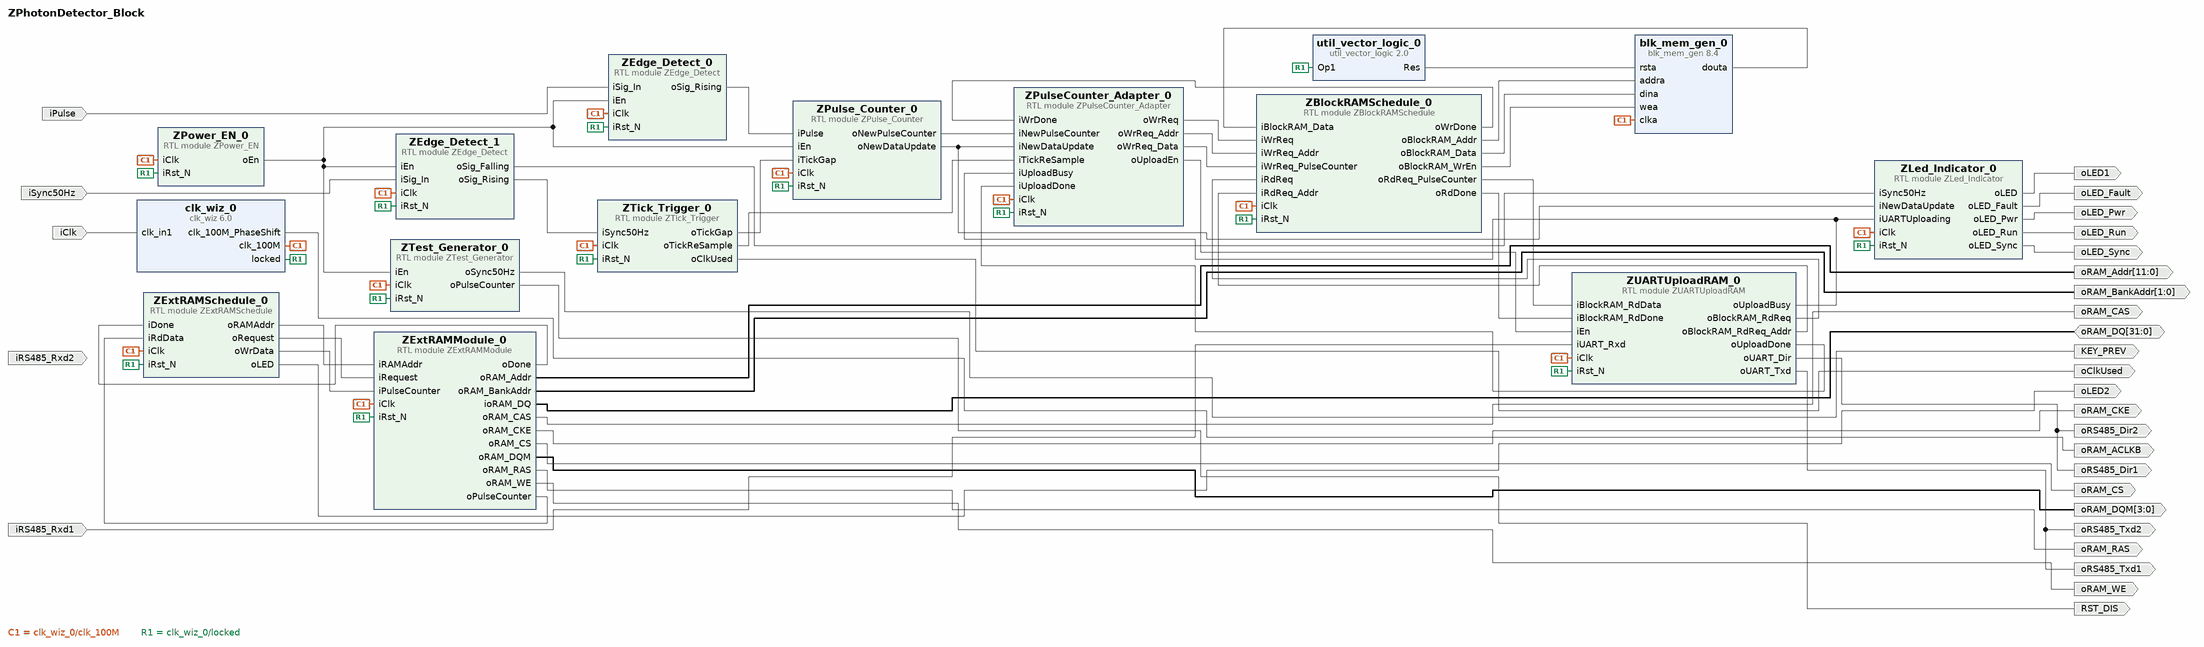
[diagram p0: block diagram of the top level]
# Vivado block design ZPhotonDetector_Block, xc7s25ftgb196-1, Vivado 2023.1
create_bd_design ZPhotonDetector_Block

create_bd_port -dir I -type clk iClk
set_property -dict {CONFIG.FREQ_HZ 100000000} [get_bd_ports iClk]
create_bd_port -dir I -type intr iPulse
create_bd_port -dir O -type data oRS485_Dir2
create_bd_port -dir O -type data oRS485_Txd2
create_bd_port -dir O -type data oRS485_Txd1
create_bd_port -dir O oRS485_Dir1
create_bd_port -dir O -from 11 -to 0 -type data oRAM_Addr
create_bd_port -dir O -from 1 -to 0 -type data oRAM_BankAddr
create_bd_port -dir O oRAM_CS
create_bd_port -dir O oRAM_WE
create_bd_port -dir O oRAM_CAS
create_bd_port -dir O oRAM_RAS
create_bd_port -dir O -type clk oRAM_ACLKB
create_bd_port -dir O -type ce oRAM_CKE
create_bd_port -dir O -from 3 -to 0 oRAM_DQM
create_bd_port -dir IO -from 31 -to 0 -type data oRAM_DQ
create_bd_port -dir O -type data oLED1
create_bd_port -dir O oLED2
create_bd_port -dir I iSync50Hz
create_bd_port -dir I iRS485_Rxd2
create_bd_port -dir I iRS485_Rxd1
create_bd_port -dir O oLED_Pwr
create_bd_port -dir O oLED_Run
create_bd_port -dir O oLED_Fault
create_bd_port -dir O oLED_Sync
create_bd_port -dir O KEY_PREV
create_bd_port -dir O RST_DIS
create_bd_port -dir O oClkUsed

create_bd_cell -type ip -vlnv xilinx.com:ip:clk_wiz:6.0 clk_wiz_0
set_property -dict [list \
  CONFIG.CLKOUT1_DRIVES BUFG \
  CONFIG.CLKOUT1_JITTER 137.681 \
  CONFIG.CLKOUT1_PHASE_ERROR 105.461 \
  CONFIG.CLKOUT1_REQUESTED_OUT_FREQ 100.0 \
  CONFIG.CLKOUT2_DRIVES BUFG \
  CONFIG.CLKOUT2_JITTER 137.681 \
  CONFIG.CLKOUT2_PHASE_ERROR 105.461 \
  CONFIG.CLKOUT2_REQUESTED_OUT_FREQ 100.0 \
  CONFIG.CLKOUT2_REQUESTED_PHASE 120 \
  CONFIG.CLKOUT2_USED true \
  CONFIG.CLKOUT3_DRIVES BUFG \
  CONFIG.CLKOUT3_JITTER 159.475 \
  CONFIG.CLKOUT3_PHASE_ERROR 105.461 \
  CONFIG.CLKOUT3_REQUESTED_OUT_FREQ 50.000 \
  CONFIG.CLKOUT3_USED false \
  CONFIG.CLKOUT4_DRIVES BUFG \
  CONFIG.CLKOUT5_DRIVES BUFG \
  CONFIG.CLKOUT6_DRIVES BUFG \
  CONFIG.CLKOUT7_DRIVES BUFG \
  CONFIG.CLK_OUT1_PORT clk_100M \
  CONFIG.CLK_OUT2_PORT clk_100M_PhaseShift \
  CONFIG.CLK_OUT3_PORT clk_50M \
  CONFIG.MMCM_BANDWIDTH OPTIMIZED \
  CONFIG.MMCM_CLKFBOUT_MULT_F 9 \
  CONFIG.MMCM_CLKOUT0_DIVIDE_F 9 \
  CONFIG.MMCM_CLKOUT1_DIVIDE 9 \
  CONFIG.MMCM_CLKOUT1_PHASE 120.000 \
  CONFIG.MMCM_CLKOUT2_DIVIDE 1 \
  CONFIG.MMCM_COMPENSATION ZHOLD \
  CONFIG.NUM_OUT_CLKS 2 \
  CONFIG.PRIMITIVE PLL \
  CONFIG.PRIM_IN_FREQ 100.000 \
  CONFIG.PRIM_SOURCE Single_ended_clock_capable_pin \
  CONFIG.USE_RESET false \
] [get_bd_cells clk_wiz_0]
create_bd_cell -type module -reference ZPower_EN ZPower_EN_0
create_bd_cell -type module -reference ZEdge_Detect ZEdge_Detect_0
create_bd_cell -type ip -vlnv xilinx.com:ip:blk_mem_gen:8.4 blk_mem_gen_0
set_property -dict [list \
  CONFIG.Enable_A Always_Enabled \
  CONFIG.Register_PortA_Output_of_Memory_Core true \
  CONFIG.Register_PortA_Output_of_Memory_Primitives false \
  CONFIG.Reset_Priority_A CE \
  CONFIG.Use_RSTA_Pin true \
  CONFIG.Write_Depth_A 3002 \
  CONFIG.Write_Width_A 16 \
  CONFIG.use_bram_block Stand_Alone \
] [get_bd_cells blk_mem_gen_0]
create_bd_cell -type module -reference ZEdge_Detect ZEdge_Detect_1
create_bd_cell -type module -reference ZExtRAMSchedule ZExtRAMSchedule_0
create_bd_cell -type module -reference ZTest_Generator ZTest_Generator_0
create_bd_cell -type module -reference ZExtRAMModule ZExtRAMModule_0
create_bd_cell -type ip -vlnv xilinx.com:ip:util_vector_logic:2.0 util_vector_logic_0
set_property -dict {CONFIG.C_OPERATION not CONFIG.C_SIZE 1} [get_bd_cells util_vector_logic_0]
create_bd_cell -type module -reference ZBlockRAMSchedule ZBlockRAMSchedule_0
create_bd_cell -type module -reference ZUARTUploadRAM ZUARTUploadRAM_0
create_bd_cell -type module -reference ZPulse_Counter ZPulse_Counter_0
create_bd_cell -type module -reference ZTick_Trigger ZTick_Trigger_0
create_bd_cell -type module -reference ZLed_Indicator ZLed_Indicator_0
create_bd_cell -type module -reference ZPulseCounter_Adapter ZPulseCounter_Adapter_0

# ---- connections ----

connect_bd_net [get_bd_ports oRAM_DQ] [get_bd_pins ZExtRAMModule_0/ioRAM_DQ]
connect_bd_net [get_bd_pins ZBlockRAMSchedule_0/oBlockRAM_Addr] [get_bd_pins blk_mem_gen_0/addra]
connect_bd_net [get_bd_pins ZBlockRAMSchedule_0/oBlockRAM_Data] [get_bd_pins blk_mem_gen_0/dina]
connect_bd_net [get_bd_pins ZBlockRAMSchedule_0/oBlockRAM_WrEn] [get_bd_pins blk_mem_gen_0/wea]
connect_bd_net -net ZBlockRAMSchedule_0_oPulseCounter [get_bd_pins ZBlockRAMSchedule_0/oRdReq_PulseCounter] \
  [get_bd_pins ZUARTUploadRAM_0/iBlockRAM_RdData]
connect_bd_net [get_bd_pins ZBlockRAMSchedule_0/oRdDone] [get_bd_pins ZUARTUploadRAM_0/iBlockRAM_RdDone]
connect_bd_net [get_bd_pins ZBlockRAMSchedule_0/oWrDone] [get_bd_pins ZPulseCounter_Adapter_0/iWrDone]
connect_bd_net [get_bd_pins ZEdge_Detect_0/oSig_Rising] [get_bd_pins ZPulse_Counter_0/iPulse]
connect_bd_net [get_bd_pins ZEdge_Detect_1/oSig_Falling] [get_bd_pins ZLed_Indicator_0/iSync50Hz]
connect_bd_net [get_bd_pins ZEdge_Detect_1/oSig_Rising] [get_bd_pins ZTick_Trigger_0/iSync50Hz]
connect_bd_net [get_bd_pins ZExtRAMModule_0/oDone] [get_bd_pins ZExtRAMSchedule_0/iDone]
connect_bd_net [get_bd_pins ZExtRAMModule_0/oPulseCounter] [get_bd_pins ZExtRAMSchedule_0/iRdData]
connect_bd_net [get_bd_pins ZExtRAMModule_0/oRAM_Addr] [get_bd_ports oRAM_Addr]
connect_bd_net [get_bd_pins ZExtRAMModule_0/oRAM_BankAddr] [get_bd_ports oRAM_BankAddr]
connect_bd_net [get_bd_pins ZExtRAMModule_0/oRAM_CAS] [get_bd_ports oRAM_CAS]
connect_bd_net [get_bd_pins ZExtRAMModule_0/oRAM_CKE] [get_bd_ports oRAM_CKE]
connect_bd_net [get_bd_pins ZExtRAMModule_0/oRAM_CS] [get_bd_ports oRAM_CS]
connect_bd_net [get_bd_pins ZExtRAMModule_0/oRAM_DQM] [get_bd_ports oRAM_DQM]
connect_bd_net [get_bd_pins ZExtRAMModule_0/oRAM_RAS] [get_bd_ports oRAM_RAS]
connect_bd_net [get_bd_pins ZExtRAMModule_0/oRAM_WE] [get_bd_ports oRAM_WE]
connect_bd_net [get_bd_pins ZExtRAMSchedule_0/oLED] [get_bd_ports oLED2]
connect_bd_net [get_bd_pins ZExtRAMSchedule_0/oRAMAddr] [get_bd_pins ZExtRAMModule_0/iRAMAddr]
connect_bd_net [get_bd_pins ZExtRAMSchedule_0/oRequest] [get_bd_pins ZExtRAMModule_0/iRequest]
connect_bd_net [get_bd_pins ZExtRAMSchedule_0/oWrData] [get_bd_pins ZExtRAMModule_0/iPulseCounter]
connect_bd_net [get_bd_pins ZLed_Indicator_0/oLED] [get_bd_ports oLED1]
connect_bd_net [get_bd_pins ZLed_Indicator_0/oLED_Fault] [get_bd_ports oLED_Fault]
connect_bd_net [get_bd_pins ZLed_Indicator_0/oLED_Pwr] [get_bd_ports oLED_Pwr]
connect_bd_net [get_bd_pins ZLed_Indicator_0/oLED_Run] [get_bd_ports oLED_Run]
connect_bd_net [get_bd_pins ZLed_Indicator_0/oLED_Sync] [get_bd_ports oLED_Sync]
connect_bd_net -net ZPulseCounter_Adapter_0_oWrFrameDone [get_bd_pins ZPulseCounter_Adapter_0/oUploadEn] [get_bd_pins ZUARTUploadRAM_0/iEn]
connect_bd_net [get_bd_pins ZPulseCounter_Adapter_0/oWrReq] [get_bd_pins ZBlockRAMSchedule_0/iWrReq]
connect_bd_net [get_bd_pins ZPulseCounter_Adapter_0/oWrReq_Addr] [get_bd_pins ZBlockRAMSchedule_0/iWrReq_Addr]
connect_bd_net [get_bd_pins ZPulseCounter_Adapter_0/oWrReq_Data] [get_bd_pins ZBlockRAMSchedule_0/iWrReq_PulseCounter]
connect_bd_net [get_bd_pins ZPulse_Counter_0/oNewDataUpdate] \
  [get_bd_pins ZLed_Indicator_0/iNewDataUpdate] [get_bd_pins ZPulseCounter_Adapter_0/iNewDataUpdate]
connect_bd_net [get_bd_pins ZPulse_Counter_0/oNewPulseCounter] [get_bd_pins ZPulseCounter_Adapter_0/iNewPulseCounter]
connect_bd_net [get_bd_pins ZTest_Generator_0/oPulseCounter] [get_bd_ports RST_DIS]
connect_bd_net [get_bd_pins ZTest_Generator_0/oSync50Hz] [get_bd_ports KEY_PREV]
connect_bd_net [get_bd_pins ZTick_Trigger_0/oClkUsed] [get_bd_ports oClkUsed]
connect_bd_net [get_bd_pins ZTick_Trigger_0/oTickGap] [get_bd_pins ZPulse_Counter_0/iTickGap]
connect_bd_net [get_bd_pins ZTick_Trigger_0/oTickReSample] [get_bd_pins ZPulseCounter_Adapter_0/iTickReSample]
connect_bd_net [get_bd_pins ZUARTUploadRAM_0/oBlockRAM_RdReq] [get_bd_pins ZBlockRAMSchedule_0/iRdReq]
connect_bd_net [get_bd_pins ZUARTUploadRAM_0/oBlockRAM_RdReq_Addr] [get_bd_pins ZBlockRAMSchedule_0/iRdReq_Addr]
connect_bd_net [get_bd_pins ZUARTUploadRAM_0/oUART_Dir] [get_bd_ports oRS485_Dir2] [get_bd_ports oRS485_Dir1]
connect_bd_net [get_bd_pins ZUARTUploadRAM_0/oUART_Txd] [get_bd_ports oRS485_Txd2] [get_bd_ports oRS485_Txd1]
connect_bd_net [get_bd_pins ZUARTUploadRAM_0/oUploadBusy] \
  [get_bd_pins ZLed_Indicator_0/iUARTUploading] [get_bd_pins ZPulseCounter_Adapter_0/iUploadBusy]
connect_bd_net [get_bd_pins ZUARTUploadRAM_0/oUploadDone] [get_bd_pins ZPulseCounter_Adapter_0/iUploadDone]
connect_bd_net [get_bd_pins blk_mem_gen_0/douta] [get_bd_pins ZBlockRAMSchedule_0/iBlockRAM_Data]
connect_bd_net [get_bd_pins clk_wiz_0/clk_100M_PhaseShift] [get_bd_ports oRAM_ACLKB]
connect_bd_net -net clk_wiz_0_clk_50M [get_bd_pins clk_wiz_0/clk_100M] \
  [get_bd_pins ZPower_EN_0/iClk] [get_bd_pins ZEdge_Detect_0/iClk] [get_bd_pins blk_mem_gen_0/clka] \
  [get_bd_pins ZEdge_Detect_1/iClk] [get_bd_pins ZExtRAMSchedule_0/iClk] [get_bd_pins ZTest_Generator_0/iClk] \
  [get_bd_pins ZExtRAMModule_0/iClk] [get_bd_pins ZBlockRAMSchedule_0/iClk] [get_bd_pins ZUARTUploadRAM_0/iClk] \
  [get_bd_pins ZPulse_Counter_0/iClk] [get_bd_pins ZTick_Trigger_0/iClk] [get_bd_pins ZLed_Indicator_0/iClk] \
  [get_bd_pins ZPulseCounter_Adapter_0/iClk]
connect_bd_net [get_bd_ports iClk] [get_bd_pins clk_wiz_0/clk_in1]
connect_bd_net -net iEn_1 [get_bd_pins ZPower_EN_0/oEn] \
  [get_bd_pins ZEdge_Detect_0/iEn] [get_bd_pins ZEdge_Detect_1/iEn] [get_bd_pins ZTest_Generator_0/iEn] \
  [get_bd_pins ZPulse_Counter_0/iEn]
connect_bd_net [get_bd_ports iPulse] [get_bd_pins ZEdge_Detect_0/iSig_In]
connect_bd_net -net iRS485_Rxd1_1 [get_bd_ports iRS485_Rxd1] [get_bd_pins ZUARTUploadRAM_0/iUART_Rxd]
connect_bd_net -net iRst_N_1 [get_bd_pins clk_wiz_0/locked] \
  [get_bd_pins ZPower_EN_0/iRst_N] [get_bd_pins ZEdge_Detect_0/iRst_N] [get_bd_pins ZEdge_Detect_1/iRst_N] \
  [get_bd_pins ZExtRAMSchedule_0/iRst_N] [get_bd_pins ZTest_Generator_0/iRst_N] [get_bd_pins ZExtRAMModule_0/iRst_N] \
  [get_bd_pins util_vector_logic_0/Op1] [get_bd_pins ZBlockRAMSchedule_0/iRst_N] [get_bd_pins ZUARTUploadRAM_0/iRst_N] \
  [get_bd_pins ZPulse_Counter_0/iRst_N] [get_bd_pins ZTick_Trigger_0/iRst_N] [get_bd_pins ZLed_Indicator_0/iRst_N] \
  [get_bd_pins ZPulseCounter_Adapter_0/iRst_N]
connect_bd_net [get_bd_ports iSync50Hz] [get_bd_pins ZEdge_Detect_1/iSig_In]
connect_bd_net [get_bd_pins util_vector_logic_0/Res] [get_bd_pins blk_mem_gen_0/rsta]

validate_bd_design
save_bd_design
